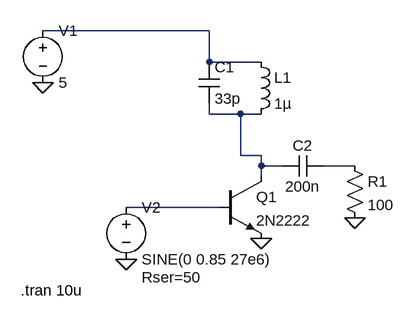
[diagram p0: schematic class_c_amp_27Mhz.asc]
class_c_amp_27Mhz.asc, the LTspice schematic file:
Version 4
SHEET 1 880 680
WIRE 160 -144 -96 -144
WIRE 160 -96 160 -144
WIRE 240 -96 160 -96
WIRE 160 -16 160 -32
WIRE 208 -16 160 -16
WIRE 240 -16 208 -16
WIRE 208 48 208 -16
WIRE 240 48 208 48
WIRE 240 64 240 48
WIRE 272 64 240 64
WIRE 384 64 336 64
WIRE 240 80 240 64
WIRE 176 128 32 128
FLAG 240 176 0
FLAG -96 -64 0
FLAG 32 208 0
FLAG 384 144 0
SYMBOL npn 176 80 R0
SYMATTR InstName Q1
SYMATTR Value 2N2222
SYMBOL voltage -96 -160 R0
WINDOW 123 0 0 Left 0
WINDOW 39 0 0 Left 0
SYMATTR InstName V1
SYMATTR Value 5
SYMBOL cap 144 -96 R0
SYMATTR InstName C1
SYMATTR Value 33p
SYMBOL ind 224 -112 R0
SYMATTR InstName L1
SYMATTR Value 1µ
SYMBOL voltage 32 112 R0
WINDOW 123 0 0 Left 0
WINDOW 39 24 124 Left 2
SYMATTR InstName V2
SYMATTR Value SINE(0 0.85 27e6)
SYMATTR SpiceLine Rser=50
SYMBOL res 368 48 R0
SYMATTR InstName R1
SYMATTR Value 100
SYMBOL cap 336 48 R90
WINDOW 0 0 32 VBottom 2
WINDOW 3 32 32 VTop 2
SYMATTR InstName C2
SYMATTR Value 200n
TEXT -130 256 Left 2 !.tran 10u

The netlist it stands for:
* class_c_amp_27Mhz.asc
Q1 N002 N004 0 0 2N2222
V1 N001 0 5
C1 N001 N002 33p
L1 N001 N002 1µ
V2 N004 0 SINE(0 0.85 27e6) Rser=50
R1 N003 0 100
C2 N003 N002 200n
.model NPN NPN
.model PNP PNP
.lib standard.bjt
.tran 10u
.backanno
.end